# Altium schematic sheet 2017-04-15_13-10-461.schdoc
size 237 x 111 mm; SheetNumber: 1; SheetTotal: 1
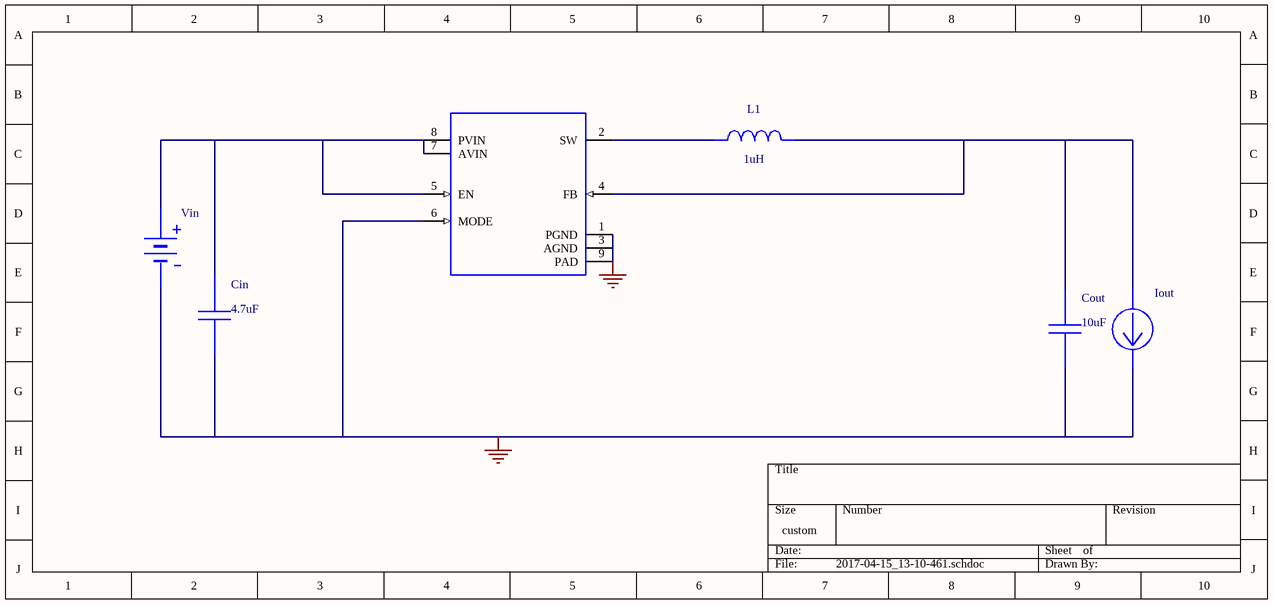
[diagram p0: 2017-04-15_13-10-461.schdoc]

## Parts
Cin  value 4.7uF  (hidden comment: GRM155R60J475ME87D)
Cout  value 10uF  (hidden comment: GRM188R60J106ME47D)
Iout  WB_CURRENT_LOAD  (value not drawn)
L1  value 1uH  (hidden comment: IHLP1212AEER1R0M11)
U1  TPS62063DSGR  (value not drawn)
Vin  WB_BATTERY  (value not drawn)

## Nets
0: Cin.2 Cout.2 Iout.2(-) U1.1(PGND) U1.3(AGND) U1.6(MODE) U1.9(PAD) Vin.2(-)
NetCin_1: Cin.1 U1.5(EN) U1.7(AVIN) U1.8(PVIN) Vin.1(+)
NetCout_1: Cout.1 Iout.1(+) L1.2 U1.4(FB)
NetL1_1: L1.1 U1.2(SW)

## Library data of the parts
Cin = GRM155R60J475ME87D: GRM155R60J475ME8; Manufacturer Name: MuRata; PackageReference: GRM155R60J475ME87D; Manufacturer Part Number: GRM155R60J475ME87D
Cout = GRM188R60J106ME47D: GRM188R60J106ME4; Manufacturer Name: MuRata; PackageReference: GRM188R60J106ME47D; Manufacturer Part Number: GRM188R60J106ME47D
L1 = IHLP1212AEER1R0M11: Unknown; Manufacturer Name: Vishay-Dale; PackageReference: IHLP1212AEER1R0M11; Manufacturer Part Number: IHLP1212AEER1R0M11
U1 = TPS62063DSGR: Manufacturer Name: Texas Instruments; PackageReference: Type; Manufacturer Part Number: TPS62063DSGR; Value: Value
Iout = WB_CURRENT_LOAD: PackageReference: WB_CURRENT_LOAD; Manufacturer Part Number: WB_CURRENT_LOAD; Manufacturer Name: WB_CURRENT_LOAD; Value: N/A
Vin = WB_BATTERY: PackageReference: WB_BATTERY; Manufacturer Part Number: WB_BATTERY; Manufacturer Name: WB_BATTERY; Value: N/A